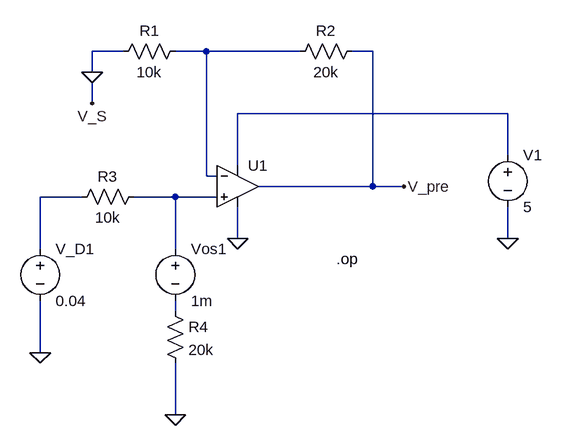
[diagram p0: schematic u1_vds_sensing(offset 1mV).asc]
u1_vds_sensing(offset 1mV).asc, the LTspice schematic file:
Version 4
SHEET 1 880 680
WIRE -32 -176 -80 -176
WIRE 96 -176 48 -176
WIRE 240 -176 96 -176
WIRE 352 -176 320 -176
WIRE -80 -144 -80 -176
WIRE -80 -96 -80 -128
WIRE 560 -80 144 -80
WIRE 560 -16 560 -80
WIRE 144 0 144 -80
WIRE 96 16 96 -176
WIRE 112 16 96 16
WIRE 352 32 352 -176
WIRE 352 32 176 32
WIRE 400 32 352 32
WIRE -96 48 -160 48
WIRE 48 48 -16 48
WIRE 112 48 48 48
WIRE 144 112 144 64
WIRE 560 112 560 64
WIRE -160 128 -160 48
WIRE 48 128 48 48
WIRE 48 224 48 208
WIRE -160 288 -160 208
WIRE 48 384 48 304
FLAG -160 288 0
FLAG 48 384 0
FLAG 144 112 0
FLAG -80 -144 0
FLAG -80 -96 V_S
FLAG 400 32 V_pre
FLAG 560 112 0
SYMBOL OpAmps\\UniversalOpAmp2 144 32 R0
SYMATTR InstName U1
SYMATTR SpiceLine Ilimit=25m Rail=0 Vos=1m
SYMBOL res 64 -192 R90
WINDOW 0 0 56 VBottom 2
WINDOW 3 32 56 VTop 2
SYMATTR InstName R1
SYMATTR Value 10k
SYMBOL res 336 -192 R90
WINDOW 0 0 56 VBottom 2
WINDOW 3 32 56 VTop 2
SYMATTR InstName R2
SYMATTR Value 20k
SYMBOL res -112 64 R270
WINDOW 0 32 56 VTop 2
WINDOW 3 0 56 VBottom 2
SYMATTR InstName R3
SYMATTR Value 10k
SYMBOL res 32 208 R0
SYMATTR InstName R4
SYMATTR Value 20k
SYMBOL voltage -160 112 R0
WINDOW 123 0 0 Left 0
WINDOW 39 0 0 Left 0
SYMATTR InstName V_D1
SYMATTR Value 0.04
SYMBOL voltage 560 -32 R0
WINDOW 123 0 0 Left 0
WINDOW 39 0 0 Left 0
SYMATTR InstName V1
SYMATTR Value 5
SYMBOL voltage 48 112 R0
WINDOW 123 0 0 Left 0
WINDOW 39 0 0 Left 0
SYMATTR InstName Vos1
SYMATTR Value 1m
TEXT 296 144 Left 2 !.op

The netlist it stands for:
* u1_vds_sensing(offset 1mV).asc
XU1 N004 N001 N002 0 V_pre level2 Avol=1Meg GBW=10Meg Slew=10Meg Ilimit=25m Rail=0 Vos=1m En=0 Enk=0 In=0 Ink=0 Rin=500Meg  ; pins In+ In- V+ V- OUT
R1 N001 0 10k
R2 V_pre N001 20k
R3 N003 N004 10k
R4 N005 0 20k
V_D1 N003 0 0.04
V1 N002 0 5
Vos1 N004 N005 1m
.op
.lib UniversalOpAmp2.lib
.backanno
.end